# Altium schematic sheet FPGA_Power.SchDoc: FPGA Motherboard for Digital Multiplexed Readout, McGill U.
size Tabloid; DocumentNumber: DfMUX9; Revision: Rev0, Prototype; SheetNumber: 9; SheetTotal: 27; PageSetup: Record=PageOptions|CenterHorizontal=True|CenterVertical=True|PrintScale=0.95|XCorrection=1.00|YCorrection=1.00|PrintKind=0|BorderSize=5000000|LeftOffset=0|BottomOffset=0|Orientation=2|PaperLength=1000|PaperWidth=1000|Scale=100|PaperSource=15|PrintQuality=300|MediaType=1|DitherType=10|PaperKind=Tabloid|PrintScaleMode=1
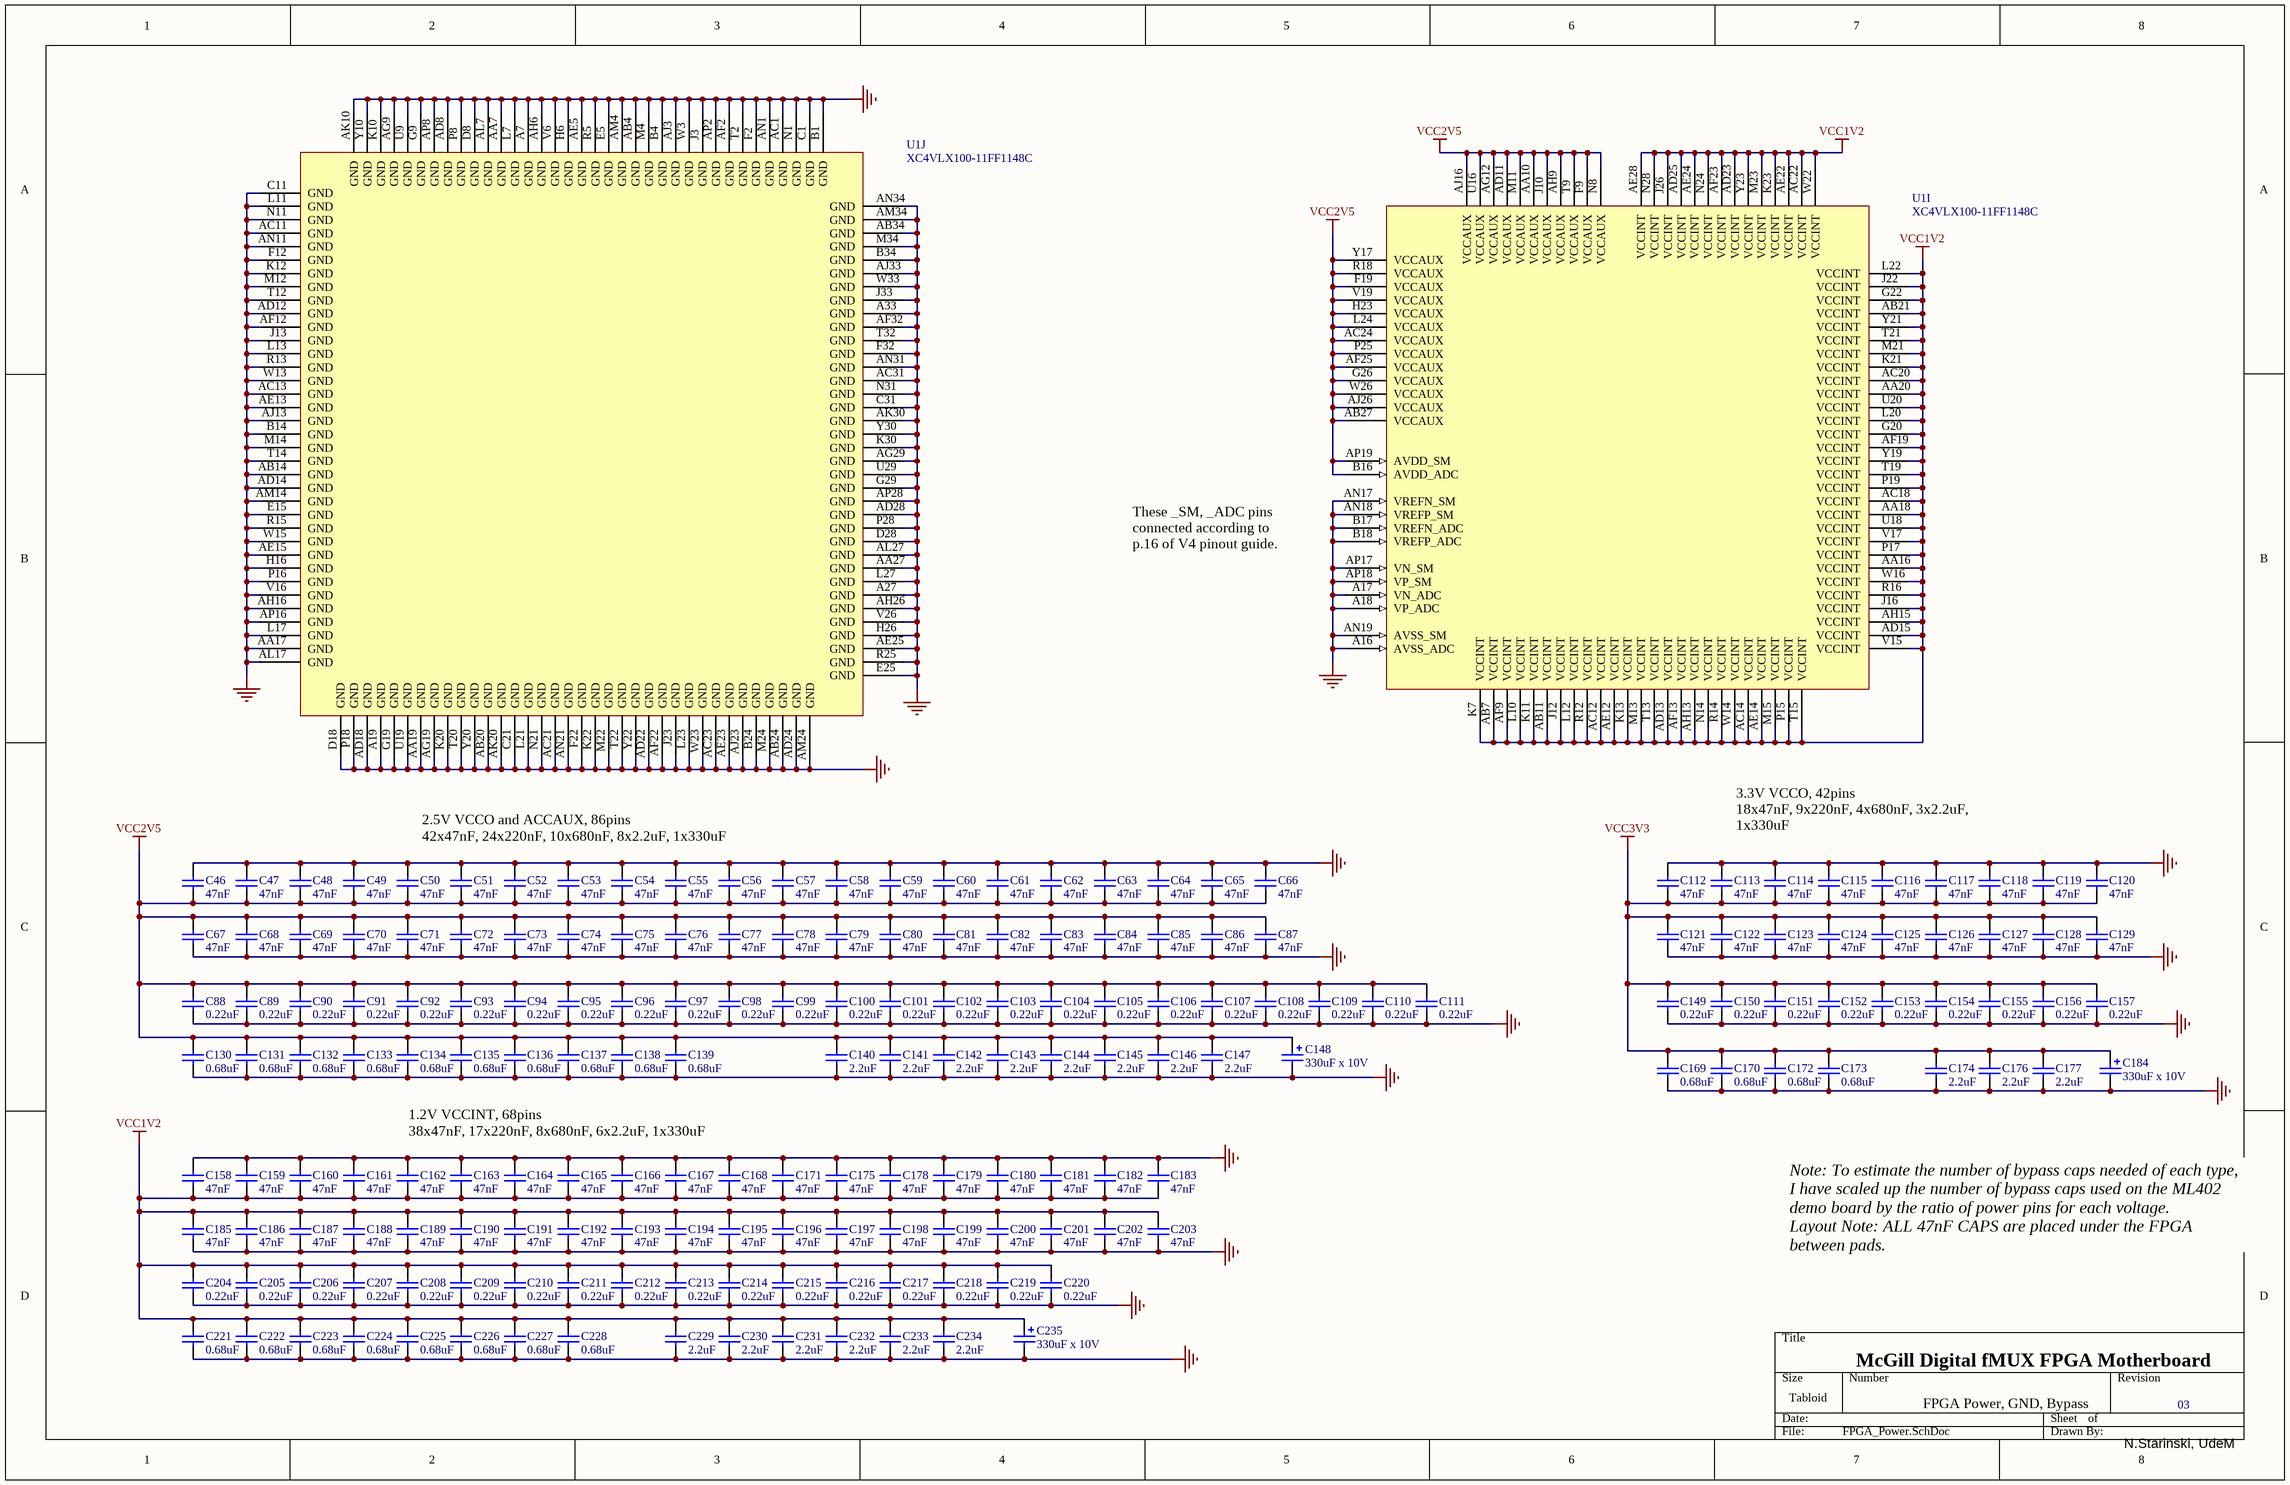
[diagram p0: FPGA_Power.SchDoc]

## Parts
C46  47nF  [CC1005-0402]
C47  47nF  [CC1005-0402]
C48  47nF  [CC1005-0402]
C49  47nF  [CC1005-0402]
C50  47nF  [CC1005-0402]
C51  47nF  [CC1005-0402]
C52  47nF  [CC1005-0402]
C53  47nF  [CC1005-0402]
C54  47nF  [CC1005-0402]
C55  47nF  [CC1005-0402]
C56  47nF  [CC1005-0402]
C57  47nF  [CC1005-0402]
C58  47nF  [CC1005-0402]
C59  47nF  [CC1005-0402]
C60  47nF  [CC1005-0402]
C61  47nF  [CC1005-0402]
C62  47nF  [CC1005-0402]
C63  47nF  [CC1005-0402]
C64  47nF  [CC1005-0402]
C65  47nF  [CC1005-0402]
C66  47nF  [CC1005-0402]
C67  47nF  [CC1005-0402]
C68  47nF  [CC1005-0402]
C69  47nF  [CC1005-0402]
C70  47nF  [CC1005-0402]
C71  47nF  [CC1005-0402]
C72  47nF  [CC1005-0402]
C73  47nF  [CC1005-0402]
C74  47nF  [CC1005-0402]
C75  47nF  [CC1005-0402]
C76  47nF  [CC1005-0402]
C77  47nF  [CC1005-0402]
C78  47nF  [CC1005-0402]
C79  47nF  [CC1005-0402]
C80  47nF  [CC1005-0402]
C81  47nF  [CC1005-0402]
C82  47nF  [CC1005-0402]
C83  47nF  [CC1005-0402]
C84  47nF  [CC1005-0402]
C85  47nF  [CC1005-0402]
C86  47nF  [CC1005-0402]
C87  47nF  [CC1005-0402]
C88  0.22uF  [CC1608-0603]
C89  0.22uF  [CC1608-0603]
C90  0.22uF  [CC1608-0603]
C91  0.22uF  [CC1608-0603]
C92  0.22uF  [CC1608-0603]
C93  0.22uF  [CC1608-0603]
C94  0.22uF  [CC1608-0603]
C95  0.22uF  [CC1608-0603]
C96  0.22uF  [CC1608-0603]
C97  0.22uF  [CC1608-0603]
C98  0.22uF  [CC1608-0603]
C99  0.22uF  [CC1608-0603]
C100  0.22uF  [CC1608-0603]
C101  0.22uF  [CC1608-0603]
C102  0.22uF  [CC1608-0603]
C103  0.22uF  [CC1608-0603]
C104  0.22uF  [CC1608-0603]
C105  0.22uF  [CC1608-0603]
C106  0.22uF  [CC1608-0603]
C107  0.22uF  [CC1608-0603]
C108  0.22uF  [CC1608-0603]
C109  0.22uF  [CC1608-0603]
C110  0.22uF  [CC1608-0603]
C111  0.22uF  [CC1608-0603]
C112  47nF  [CC1005-0402]
C113  47nF  [CC1005-0402]
C114  47nF  [CC1005-0402]
C115  47nF  [CC1005-0402]
C116  47nF  [CC1005-0402]
C117  47nF  [CC1005-0402]
C118  47nF  [CC1005-0402]
C119  47nF  [CC1005-0402]
C120  47nF  [CC1005-0402]
C121  47nF  [CC1005-0402]
C122  47nF  [CC1005-0402]
C123  47nF  [CC1005-0402]
C124  47nF  [CC1005-0402]
C125  47nF  [CC1005-0402]
C126  47nF  [CC1005-0402]
C127  47nF  [CC1005-0402]
C128  47nF  [CC1005-0402]
C129  47nF  [CC1005-0402]
C130  0.68uF  [CC3216-1206]
C131  0.68uF  [CC3216-1206]
C132  0.68uF  [CC3216-1206]
C133  0.68uF  [CC3216-1206]
C134  0.68uF  [CC3216-1206]
C135  0.68uF  [CC3216-1206]
C136  0.68uF  [CC3216-1206]
C137  0.68uF  [CC3216-1206]
C138  0.68uF  [CC3216-1206]
C139  0.68uF  [CC3216-1206]
C140  2.2uF  [CC3216-1206]
C141  2.2uF  [CC3216-1206]
C142  2.2uF  [CC3216-1206]
C143  2.2uF  [CC3216-1206]
C144  2.2uF  [CC3216-1206]
C145  2.2uF  [CC3216-1206]
C146  2.2uF  [CC3216-1206]
C147  2.2uF  [CC3216-1206]
C148  330uF x 10V  [CC7343-31_Dsize]
C149  0.22uF  [CC1608-0603]
C150  0.22uF  [CC1608-0603]
C151  0.22uF  [CC1608-0603]
C152  0.22uF  [CC1608-0603]
C153  0.22uF  [CC1608-0603]
C154  0.22uF  [CC1608-0603]
C155  0.22uF  [CC1608-0603]
C156  0.22uF  [CC1608-0603]
C157  0.22uF  [CC1608-0603]
C158  47nF  [CC1005-0402]
C159  47nF  [CC1005-0402]
C160  47nF  [CC1005-0402]
C161  47nF  [CC1005-0402]
C162  47nF  [CC1005-0402]
C163  47nF  [CC1005-0402]
C164  47nF  [CC1005-0402]
C165  47nF  [CC1005-0402]
C166  47nF  [CC1005-0402]
C167  47nF  [CC1005-0402]
C168  47nF  [CC1005-0402]
C169  0.68uF  [CC3216-1206]
C170  0.68uF  [CC3216-1206]
C171  47nF  [CC1005-0402]
C172  0.68uF  [CC3216-1206]
C173  0.68uF  [CC3216-1206]
C174  2.2uF  [CC3216-1206]
C175  47nF  [CC1005-0402]
C176  2.2uF  [CC3216-1206]
C177  2.2uF  [CC3216-1206]
C178  47nF  [CC1005-0402]
C179  47nF  [CC1005-0402]
C180  47nF  [CC1005-0402]
C181  47nF  [CC1005-0402]
C182  47nF  [CC1005-0402]
C183  47nF  [CC1005-0402]
C184  330uF x 10V  [CC7343-31_Dsize]
C185  47nF  [CC1005-0402]
C186  47nF  [CC1005-0402]
C187  47nF  [CC1005-0402]
C188  47nF  [CC1005-0402]
C189  47nF  [CC1005-0402]
C190  47nF  [CC1005-0402]
C191  47nF  [CC1005-0402]
C192  47nF  [CC1005-0402]
C193  47nF  [CC1005-0402]
C194  47nF  [CC1005-0402]
C195  47nF  [CC1005-0402]
C196  47nF  [CC1005-0402]
C197  47nF  [CC1005-0402]
C198  47nF  [CC1005-0402]
C199  47nF  [CC1005-0402]
C200  47nF  [CC1005-0402]
C201  47nF  [CC1005-0402]
C202  47nF  [CC1005-0402]
C203  47nF  [CC1005-0402]
C204  0.22uF  [CC1608-0603]
C205  0.22uF  [CC1608-0603]
C206  0.22uF  [CC1608-0603]
C207  0.22uF  [CC1608-0603]
C208  0.22uF  [CC1608-0603]
C209  0.22uF  [CC1608-0603]
C210  0.22uF  [CC1608-0603]
C211  0.22uF  [CC1608-0603]
C212  0.22uF  [CC1608-0603]
C213  0.22uF  [CC1608-0603]
C214  0.22uF  [CC1608-0603]
C215  0.22uF  [CC1608-0603]
C216  0.22uF  [CC1608-0603]
C217  0.22uF  [CC1608-0603]
C218  0.22uF  [CC1608-0603]
C219  0.22uF  [CC1608-0603]
C220  0.22uF  [CC1608-0603]
C221  0.68uF  [CC3216-1206]
C222  0.68uF  [CC3216-1206]
C223  0.68uF  [CC3216-1206]
C224  0.68uF  [CC3216-1206]
C225  0.68uF  [CC3216-1206]
C226  0.68uF  [CC3216-1206]
C227  0.68uF  [CC3216-1206]
C228  0.68uF  [CC3216-1206]
C229  2.2uF  [CC3216-1206]
C230  2.2uF  [CC3216-1206]
C231  2.2uF  [CC3216-1206]
C232  2.2uF  [CC3216-1206]
C233  2.2uF  [CC3216-1206]
C234  2.2uF  [CC3216-1206]
C235  330uF x 10V  [CC7343-31_Dsize]
U1  XC4VLX100-11FF1148C  [FF1148]  (parts I,J of 10)

## Nets
GND: C46.2 C47.2 C48.2 C49.2 C50.2 C51.2 C52.2 C53.2 C54.2 C55.2 C56.2 C57.2 C58.2 C59.2 C60.2 C61.2 C62.2 C63.2 C64.2 C65.2 C66.2 C67.1 C68.1 C69.1 C70.1 C71.1 C72.1 C73.1 C74.1 C75.1 C76.1 C77.1 C78.1 C79.1 C80.1 C81.1 C82.1 C83.1 C84.1 C85.1 C86.1 C87.1 C88.1 C89.1 C90.1 C91.1 C92.1 C93.1 C94.1 C95.1 C96.1 C97.1 C98.1 C99.1 C100.1 C101.1 C102.1 C103.1 C104.1 C105.1 C106.1 C107.1 C108.1 C109.1 C110.1 C111.1 C112.2 C113.2 C114.2 C115.2 C116.2 C117.2 C118.2 C119.2 C120.2 C121.1 C122.1 C123.1 C124.1 C125.1 C126.1 C127.1 C128.1 C129.1 C130.1 C131.1 C132.1 C133.1 C134.1 C135.1 C136.1 C137.1 C138.1 C139.1 C140.1 C141.1 C142.1 C143.1 C144.1 C145.1 C146.1 C147.1 C148.2 C149.1 C150.1 C151.1 C152.1 C153.1 C154.1 C155.1 C156.1 C157.1 C158.2 C159.2 C160.2 C161.2 C162.2 C163.2 C164.2 C165.2 C166.2 C167.2 C168.2 C169.1 C170.1 C171.2 C172.1 C173.1 C174.1 C175.2 C176.1 C177.1 C178.2 C179.2 C180.2 C181.2 C182.2 C183.2 C184.2 C185.1 C186.1 C187.1 C188.1 C189.1 C190.1 C191.1 C192.1 C193.1 C194.1 C195.1 C196.1 C197.1 C198.1 C199.1 C200.1 C201.1 C202.1 C203.1 C204.1 C205.1 C206.1 C207.1 C208.1 C209.1 C210.1 C211.1 C212.1 C213.1 C214.1 C215.1 C216.1 C217.1 C218.1 C219.1 C220.1 C221.1 C222.1 C223.1 C224.1 C225.1 C226.1 C227.1 C228.1 C229.1 C230.1 C231.1 C232.1 C233.1 C234.1 C235.2 U1.A7(GND) U1.A16(AVSS_ADC) U1.A17(VN_ADC) U1.A18(VP_ADC) U1.A19(GND) U1.A27(GND) U1.A33(GND) U1.AA7(GND) U1.AA17(GND) U1.AA19(GND) U1.AA27(GND) U1.AB4(GND) U1.AB14(GND) U1.AB20(GND) U1.AB24(GND) U1.AB34(GND) U1.AC1(GND) U1.AC11(GND) U1.AC13(GND) U1.AC21(GND) U1.AC23(GND) U1.AC31(GND) U1.AD8(GND) U1.AD12(GND) U1.AD14(GND) U1.AD18(GND) U1.AD22(GND) U1.AD24(GND) U1.AD28(GND) U1.AE5(GND) U1.AE13(GND) U1.AE15(GND) U1.AE23(GND) U1.AE25(GND) U1.AF2(GND) U1.AF12(GND) U1.AF22(GND) U1.AF32(GND) U1.AG9(GND) U1.AG19(GND) U1.AG29(GND) U1.AH6(GND) U1.AH16(GND) U1.AH26(GND) U1.AJ3(GND) U1.AJ13(GND) U1.AJ23(GND) U1.AJ33(GND) U1.AK10(GND) U1.AK20(GND) U1.AK30(GND) U1.AL7(GND) U1.AL17(GND) U1.AL27(GND) U1.AM4(GND) U1.AM14(GND) U1.AM24(GND) U1.AM34(GND) U1.AN1(GND) U1.AN11(GND) U1.AN17(VREFN_SM) U1.AN18(VREFP_SM) U1.AN19(AVSS_SM) U1.AN21(GND) U1.AN31(GND) U1.AN34(GND) U1.AP2(GND) U1.AP8(GND) U1.AP16(GND) U1.AP17(VN_SM) U1.AP18(VP_SM) U1.AP28(GND) U1.B1(GND) U1.B4(GND) U1.B14(GND) U1.B17(VREFN_ADC) U1.B18(VREFP_ADC) U1.B24(GND) U1.B34(GND) U1.C1(GND) U1.C11(GND) U1.C21(GND) U1.C31(GND) U1.D8(GND) U1.D18(GND) U1.D28(GND) U1.E5(GND) U1.E15(GND) U1.E25(GND) U1.F2(GND) U1.F12(GND) U1.F22(GND) U1.F32(GND) U1.G9(GND) U1.G19(GND) U1.G29(GND) U1.H6(GND) U1.H16(GND) U1.H26(GND) U1.J3(GND) U1.J13(GND) U1.J23(GND) U1.J33(GND) U1.K10(GND) U1.K12(GND) U1.K20(GND) U1.K22(GND) U1.K30(GND) U1.L7(GND) U1.L11(GND) U1.L13(GND) U1.L17(GND) U1.L21(GND) U1.L23(GND) U1.L27(GND) U1.M4(GND) U1.M12(GND) U1.M14(GND) U1.M22(GND) U1.M24(GND) U1.M34(GND) U1.N1(GND) U1.N11(GND) U1.N21(GND) U1.N31(GND) U1.P8(GND) U1.P16(GND) U1.P18(GND) U1.P28(GND) U1.R5(GND) U1.R13(GND) U1.R15(GND) U1.R25(GND) U1.T2(GND) U1.T12(GND) U1.T14(GND) U1.T20(GND) U1.T22(GND) U1.T32(GND) U1.U9(GND) U1.U19(GND) U1.U29(GND) U1.V6(GND) U1.V16(GND) U1.V26(GND) U1.W3(GND) U1.W13(GND) U1.W15(GND) U1.W23(GND) U1.W33(GND) U1.Y10(GND) U1.Y20(GND) U1.Y22(GND) U1.Y30(GND)
VCC1V2: C158.1 C159.1 C160.1 C161.1 C162.1 C163.1 C164.1 C165.1 C166.1 C167.1 C168.1 C171.1 C175.1 C178.1 C179.1 C180.1 C181.1 C182.1 C183.1 C185.2 C186.2 C187.2 C188.2 C189.2 C190.2 C191.2 C192.2 C193.2 C194.2 C195.2 C196.2 C197.2 C198.2 C199.2 C200.2 C201.2 C202.2 C203.2 C204.2 C205.2 C206.2 C207.2 C208.2 C209.2 C210.2 C211.2 C212.2 C213.2 C214.2 C215.2 C216.2 C217.2 C218.2 C219.2 C220.2 C221.2 C222.2 C223.2 C224.2 C225.2 C226.2 C227.2 C228.2 C229.2 C230.2 C231.2 C232.2 C233.2 C234.2 C235.1 U1.AA16(VCCINT) U1.AA18(VCCINT) U1.AA20(VCCINT) U1.AB7(VCCINT) U1.AB11(VCCINT) U1.AB21(VCCINT) U1.AC12(VCCINT) U1.AC14(VCCINT) U1.AC18(VCCINT) U1.AC20(VCCINT) U1.AC22(VCCINT) U1.AD13(VCCINT) U1.AD15(VCCINT) U1.AD23(VCCINT) U1.AD25(VCCINT) U1.AE12(VCCINT) U1.AE14(VCCINT) U1.AE22(VCCINT) U1.AE24(VCCINT) U1.AE28(VCCINT) U1.AF9(VCCINT) U1.AF13(VCCINT) U1.AF19(VCCINT) U1.AF23(VCCINT) U1.AH13(VCCINT) U1.AH15(VCCINT) U1.G20(VCCINT) U1.G22(VCCINT) U1.J12(VCCINT) U1.J16(VCCINT) U1.J22(VCCINT) U1.J26(VCCINT) U1.K7(VCCINT) U1.K11(VCCINT) U1.K13(VCCINT) U1.K21(VCCINT) U1.K23(VCCINT) U1.L10(VCCINT) U1.L12(VCCINT) U1.L20(VCCINT) U1.L22(VCCINT) U1.M13(VCCINT) U1.M15(VCCINT) U1.M21(VCCINT) U1.M23(VCCINT) U1.N14(VCCINT) U1.N24(VCCINT) U1.N28(VCCINT) U1.P15(VCCINT) U1.P17(VCCINT) U1.P19(VCCINT) U1.R12(VCCINT) U1.R14(VCCINT) U1.R16(VCCINT) U1.T13(VCCINT) U1.T15(VCCINT) U1.T19(VCCINT) U1.T21(VCCINT) U1.U18(VCCINT) U1.U20(VCCINT) U1.V15(VCCINT) U1.V17(VCCINT) U1.W14(VCCINT) U1.W16(VCCINT) U1.W22(VCCINT) U1.Y19(VCCINT) U1.Y21(VCCINT) U1.Y23(VCCINT)
VCC2V5: C46.1 C47.1 C48.1 C49.1 C50.1 C51.1 C52.1 C53.1 C54.1 C55.1 C56.1 C57.1 C58.1 C59.1 C60.1 C61.1 C62.1 C63.1 C64.1 C65.1 C66.1 C67.2 C68.2 C69.2 C70.2 C71.2 C72.2 C73.2 C74.2 C75.2 C76.2 C77.2 C78.2 C79.2 C80.2 C81.2 C82.2 C83.2 C84.2 C85.2 C86.2 C87.2 C88.2 C89.2 C90.2 C91.2 C92.2 C93.2 C94.2 C95.2 C96.2 C97.2 C98.2 C99.2 C100.2 C101.2 C102.2 C103.2 C104.2 C105.2 C106.2 C107.2 C108.2 C109.2 C110.2 C111.2 C130.2 C131.2 C132.2 C133.2 C134.2 C135.2 C136.2 C137.2 C138.2 C139.2 C140.2 C141.2 C142.2 C143.2 C144.2 C145.2 C146.2 C147.2 C148.1 U1.AA10(VCCAUX) U1.AB27(VCCAUX) U1.AC24(VCCAUX) U1.AD11(VCCAUX) U1.AF25(VCCAUX) U1.AG12(VCCAUX) U1.AH9(VCCAUX) U1.AJ16(VCCAUX) U1.AJ26(VCCAUX) U1.AP19(AVDD_SM) U1.B16(AVDD_ADC) U1.F9(VCCAUX) U1.F19(VCCAUX) U1.G26(VCCAUX) U1.H23(VCCAUX) U1.J10(VCCAUX) U1.L24(VCCAUX) U1.M11(VCCAUX) U1.N8(VCCAUX) U1.P25(VCCAUX) U1.R18(VCCAUX) U1.T9(VCCAUX) U1.U16(VCCAUX) U1.V19(VCCAUX) U1.W26(VCCAUX) U1.Y17(VCCAUX)
VCC3V3: C112.1 C113.1 C114.1 C115.1 C116.1 C117.1 C118.1 C119.1 C120.1 C121.2 C122.2 C123.2 C124.2 C125.2 C126.2 C127.2 C128.2 C129.2 C149.2 C150.2 C151.2 C152.2 C153.2 C154.2 C155.2 C156.2 C157.2 C169.2 C170.2 C172.2 C173.2 C174.2 C176.2 C177.2 C184.1

## Notes on the sheet
- These _SM, _ADC pins connected according to p.16 of V4 pinout guide.
- 3.3V VCCO, 42pins
  18x47nF, 9x220nF, 4x680nF, 3x2.2uF, 1x330uF
- 2.5V VCCO and ACCAUX, 86pins
  42x47nF, 24x220nF, 10x680nF, 8x2.2uF, 1x330uF
- 1.2V VCCINT, 68pins
  38x47nF, 17x220nF, 8x680nF, 6x2.2uF, 1x330uF
- Note: To estimate the number of bypass caps needed of each type, I have scaled up the number of bypass caps used on the ML402 demo board by the ratio of power pins for each voltage.
  Layout Note: ALL 47nF CAPS are placed under the FPGA between pads.
- McGill Digital fMUX FPGA Motherboard
- FPGA Power, GND, Bypass
- 03
- N.Starinski, UdeM

## Library data of the parts
C46-C147 C149-C183 C185-C234 = Cap Semi: Capacitor (Semiconductor SIM Model); Published: 8-Jun-2000; LatestRevisionDate: 17-Jul-2002; LatestRevisionNote: Re-released for DXP Platform.; PackageReference: C1206; Publisher: Altium Limited
C148 C184 C235 = Cap Pol3: CAP TANTD TPSD337K010R0100; Published: 8-Jun-2000; LatestRevisionDate: 17-Jul-2002; LatestRevisionNote: Re-released for DXP Platform.; PackageReference: C0805; Publisher: Altium Limited
U1 = XC4VLX100-11FF1148C: Xilinx Virtex-4 LX Platform FPGA, 1148-Ball FFBGA, Speed Grade 11, 768 User I/Os, Commercial Grade; PackageDocument: ver1.0, Oct-2002; Published: 13-Dec-2004; LatestRevisionDate: 4-Mar-2005; LatestRevisionNote: D_IN & CS_B pins changed from I/O to Input. DOUT_BUSY pin changed from I/O to Output.; DatasheetDocument: ver1.2, Dec-2004; PackageReference: FF1148; Publisher: Altium Limited; ComponentLink2Description: Virtex-4 Overview; ComponentLink2URL: http://www.xilinx.com/products/virtex4/overview.htm; ComponentLink3Description: Datasheet; ComponentLink3URL: http://direct.xilinx.com/bvdocs/userguides/ug075.pdf; Code_JEDEC: MS-034-AAR-1